# EAGLE design Amp5 (EAGLE 5.11)
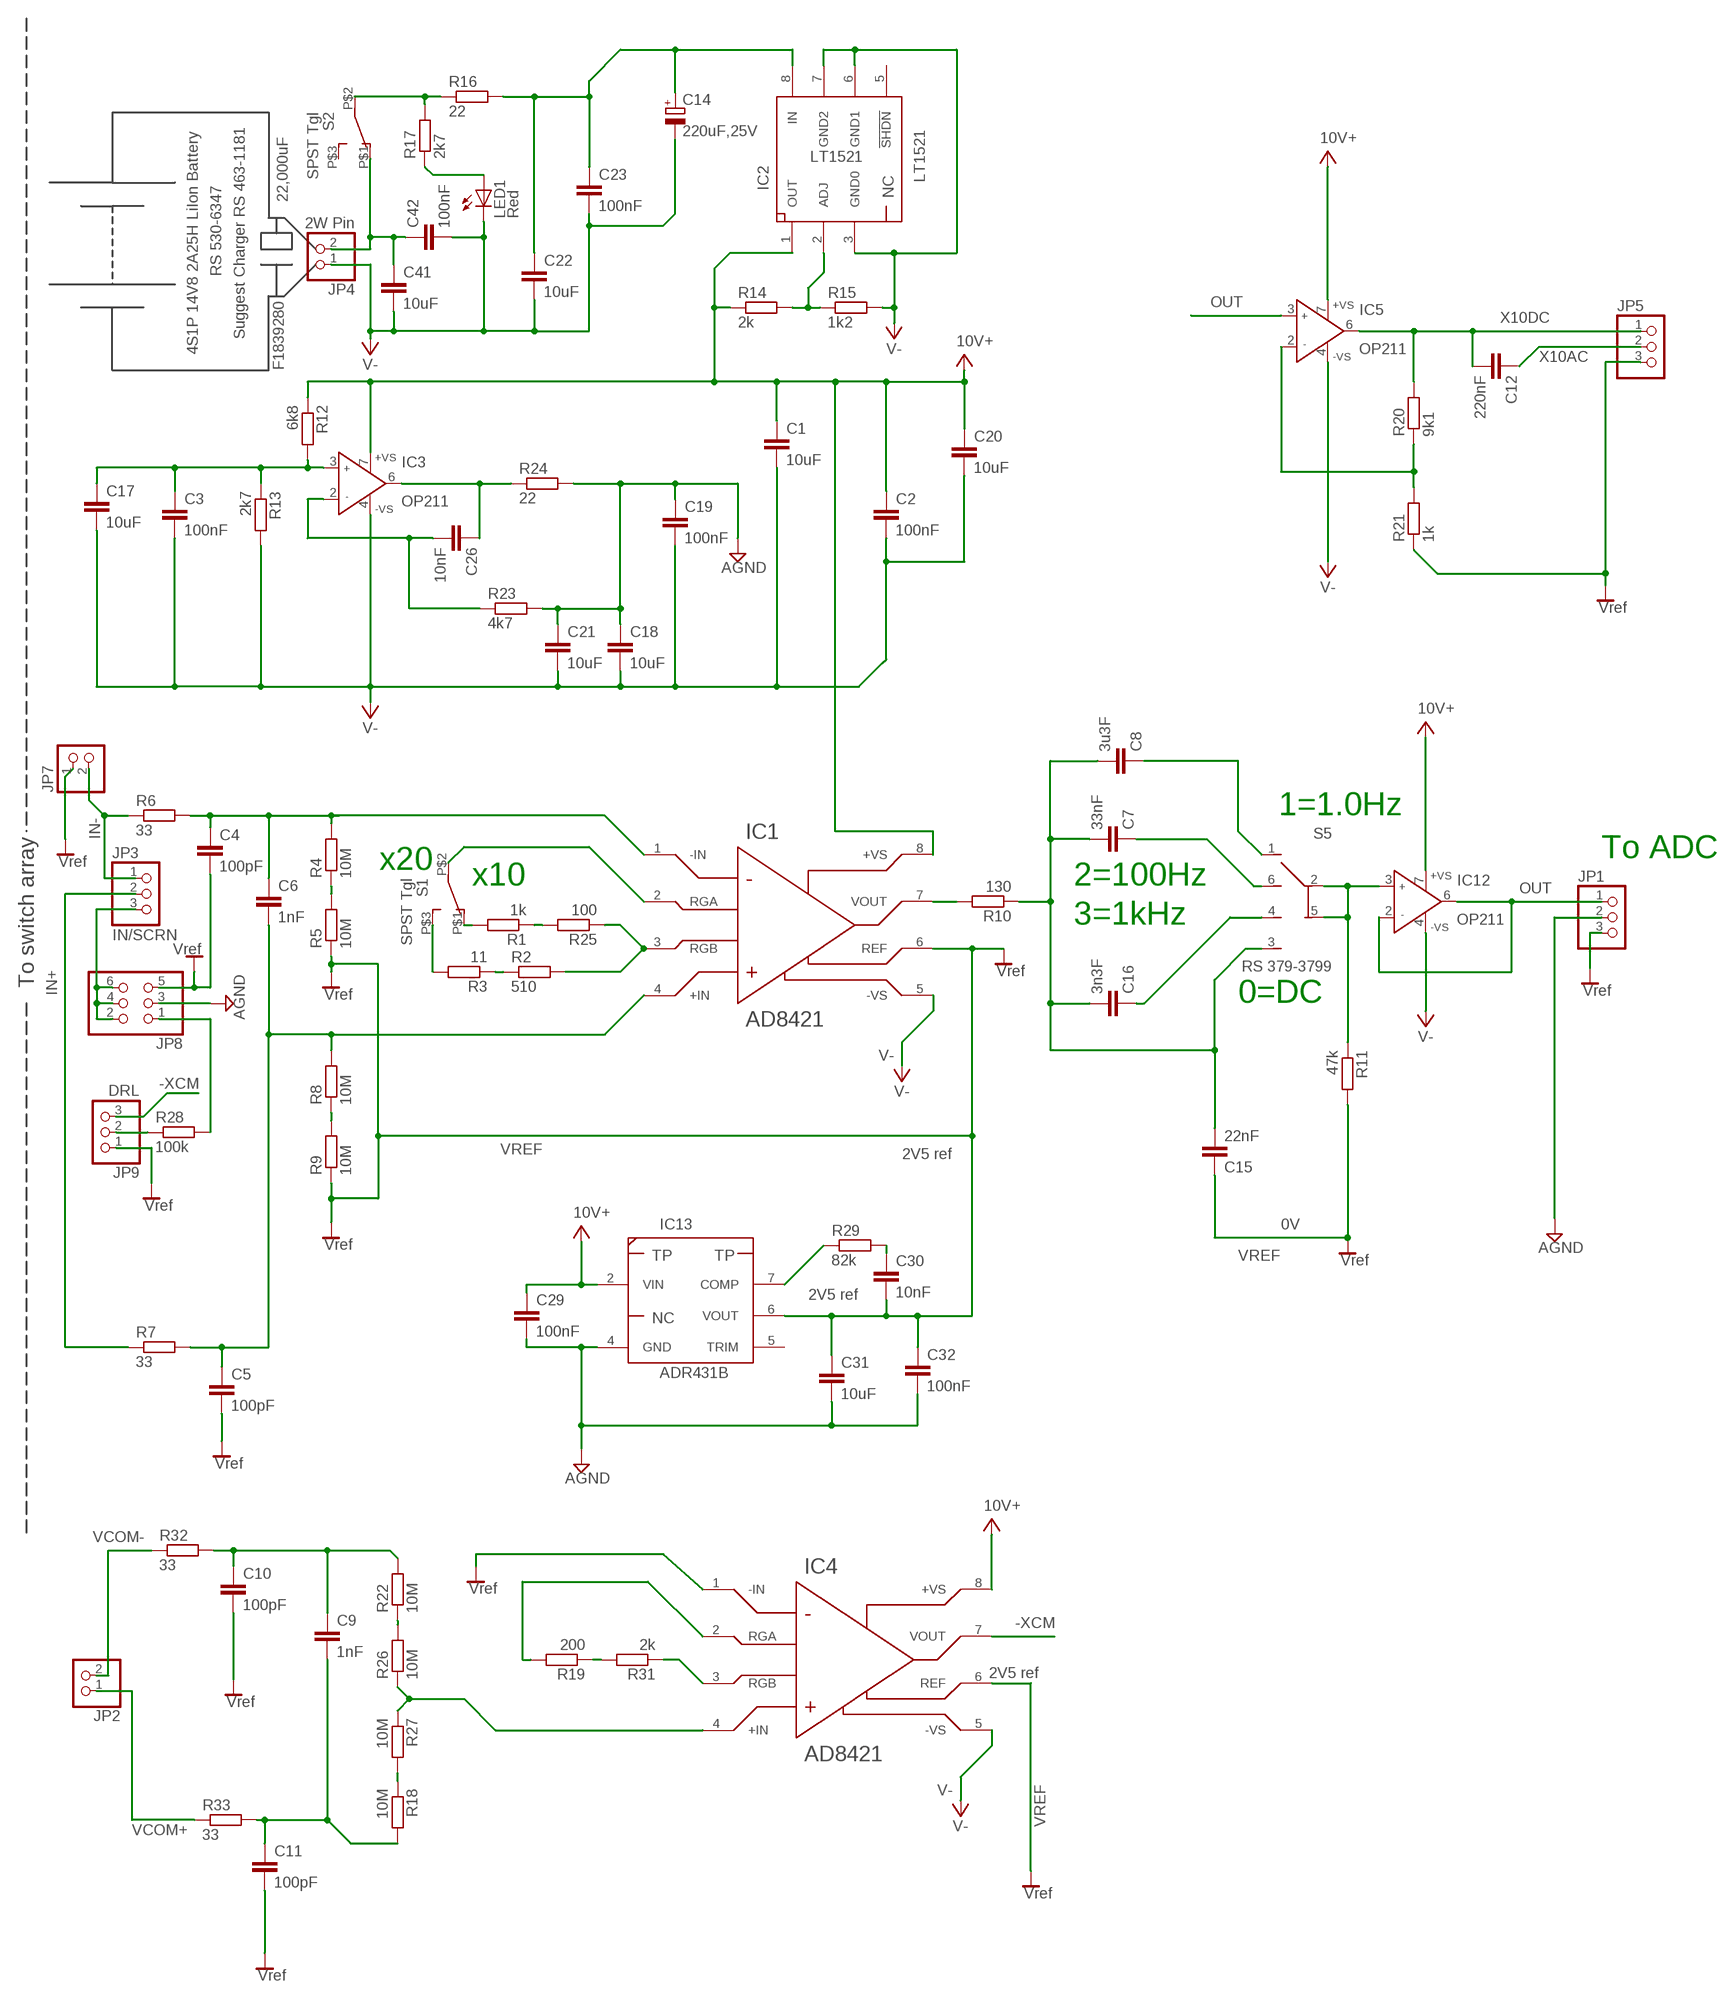
[diagram p0: schematic, sheet 1]

## Parts
C1  10uF  C-EUC1206  [C1206]
C2  100nF  C-EUC1206  [C1206]
C3  100nF  C-EUC1206  [C1206]
C4  100pF  C-EUC1206  [C1206]
C5  100pF  C-EUC1206  [C1206]
C6  1nF  C-EUC1206  [C1206]
C7  33nF  C-EUC1206  [C1206]
C8  3u3F  C-EUC1206  [C1206]
C9  1nF  C-EUC1206  [C1206]
C10  100pF  C-EUC1206  [C1206]
C11  100pF  C-EUC1206  [C1206]
C12  220nF  C-EUC1206  [C1206]
C14  220uF,25V  CPOL-EUE5-10.5  [E5-10,5]
C15  22nF  C-EUC1206  [C1206]
C16  3n3F  C-EUC1206  [C1206]
C17  10uF  C-EUC1206  [C1206]
C18  10uF  C-EUC1206  [C1206]
C19  100nF  C-EUC1206  [C1206]
C20  10uF  C-EUC1206  [C1206]
C21  10uF  C-EUC1206  [C1206]
C22  10uF  C-EUC1206  [C1206]
C23  100nF  C-EUC1206  [C1206]
C26  10nF  C-EUC1206  [C1206]
C29  100nF  C-EUC1206  [C1206]
C30  10nF  C-EUC1206  [C1206]
C31  10uF  C-EUC1206  [C1206]
C32  100nF  C-EUC1206  [C1206]
C41  10uF  C-EUC1206  [C1206]
C42  100nF  C-EUC1206  [C1206]
IC1  AD8421  [SO8]
IC2  LT1521  [SOIC8]
IC3  OP211  [SO-08]
IC4  AD8421  [SO8]
IC5  OP211  [SO-08]
IC12  OP211  [SO-08]
IC13  ADR431B  ADR43X  [SO-08]
JP1  PINHD-1X3  [1X03]
JP2  PINHD-1X2  [1X02]
JP3  IN/SCRN  PINHD-1X3  [1X03]
JP4  2W Pin  PINHD-1X2  [1X02]
JP5  PINHD-1X3  [1X03]
JP7  PINHD-1X2  [1X02]
JP8  PINHD-2X3  [2X03]
JP9  DRL  PINHD-1X3  [1X03]
LED1  Red  LED5MMR  [LED5MM]
R1  1k  R-EU_R0603  [R0603]
R2  510  R-EU_R0603  [R0603]
R3  11  R-EU_R0603  [R0603]
R4  10M  R-EU_R0603  [R0603]
R5  10M  R-EU_R0603  [R0603]
R6  33  R-EU_R0603  [R0603]
R7  33  R-EU_R0603  [R0603]
R8  10M  R-EU_R0603  [R0603]
R9  10M  R-EU_R0603  [R0603]
R10  130  R-EU_R0603  [R0603]
R11  47k  R-EU_R0603  [R0603]
R12  6k8  R-EU_R0603  [R0603]
R13  2k7  R-EU_R0603  [R0603]
R14  2k  R-EU_R0603  [R0603]
R15  1k2  R-EU_R0603  [R0603]
R16  22  R-EU_R0603  [R0603]
R17  2k7  R-EU_0309/10  [0309/10]
R18  10M  R-EU_R0603  [R0603]
R19  200  R-EU_R0603  [R0603]
R20  9k1  R-EU_R0603  [R0603]
R21  1k  R-EU_R0603  [R0603]
R22  10M  R-EU_R0603  [R0603]
R23  4k7  R-EU_R0603  [R0603]
R24  22  R-EU_R0603  [R0603]
R25  100  R-EU_R0603  [R0603]
R26  10M  R-EU_R0603  [R0603]
R27  10M  R-EU_R0603  [R0603]
R28  100k  R-EU_R0603  [R0603]
R29  82k  R-EU_R0603  [R0603]
R31  2k  R-EU_R0603  [R0603]
R32  33  R-EU_R0603  [R0603]
R33  33  R-EU_R0603  [R0603]
S1  SPST Tgl  SPDTSTGL  [SPDTSTGL]
S2  SPST Tgl  SPDTSTGL  [SPDTSTGL]
S5  RS 379-3799  SP_4W_DIL  [SP4W_DIL_SW]

## Nets
-XCM: IC4.7(VOUT) JP9.3
AGND: C18.1 C19.1 C21.1 C29.2 C31.2 C32.2 IC13.4(GND) JP1.2 JP8.3 R23.2 R24.2
DRL: JP8.1 R28.2
IN: C14.+ C22.1 C23.1 IC2.8(IN) R16.2
IN+: JP3.2 R7.1
IN-: JP3.1 JP7.2 R6.1
N$1: IC2.2(ADJ) R14.2 R15.1
N$2: C5.1 C6.2 IC1.4(+IN) R7.2 R8.2
N$3: IC1.7(VOUT) R10.2
N$4: R8.1 R9.2
N$5: IC1.2(RGA) S1.P$2(P)
N$6: R1.2 S1.P$1(O)
N$7: IC1.3(RGB) R2.2 R25.1
N$8: R3.2 S1.P$3(S)
N$9: R2.1 R3.1
N$10: C4.1 C6.1 IC1.1(-IN) R4.2 R6.2
N$11: C7.1 S5.6
N$12: R4.1 R5.2
N$13: C8.1 S5.1
N$14: C26.2 IC3.2(IN-) R23.1
N$15: C41.1 C42.1 JP4.2 S2.P$1(O)
N$16: C7.2 C8.2 C15.2 C16.2 R10.1 S5.3
N$17: R1.1 R25.2
N$18: C16.1 S5.4
N$19: LED1.A R17.1
N$20: C26.1 IC3.6(OUT) R24.1
N$21: IC5.2(IN-) R20.1 R21.2
N$22: IC12.3(IN+) R11.1 S5.2(CA) S5.5(CB)
N$23: R16.1 R17.2 S2.P$2(P)
N$24: C3.1 C17.1 IC3.3(IN+) R12.2 R13.1
N$25: JP3.3 JP8.2 JP8.4 JP8.6
N$26: IC4.2(RGA) R19.2
N$27: JP9.2 R28.1
N$29: IC13.7(COMP) R29.1
N$30: C30.1 R29.2
N$33: IC4.3(RGB) R31.1
N$34: R22.1 R26.2
N$35: R18.1 R27.2
N$38: R19.1 R31.2
N$39: C9.1 C10.1 R22.2 R32.2
N$40: C9.2 C11.1 R18.2 R33.2
OUT: IC5.3(IN+) IC12.2(IN-) IC12.6(OUT) JP1.1
V+: C1.1 C2.1 C20.1 C29.1 IC1.8(+VS) IC2.1(OUT) IC3.7(+VS) IC4.8(+VS) IC5.7(+VS) IC12.7(+VS) IC13.2(VIN) R12.1 R14.1 ; supply symbol labelled 10V+
V-: C1.2 C2.2 C3.2 C14.- C17.2 C18.2 C19.2 C20.2 C21.2 C22.2 C23.2 C41.2 C42.2 IC1.5(-VS) IC2.3(GND0) IC2.6(GND1) IC2.7(GND2) IC3.4(-VS) IC4.5(-VS) IC5.4(-VS) IC12.4(-VS) JP4.1 LED1.K(C) R13.2 R15.2
VCOM+: JP2.1 R33.1
VCOM-: JP2.2 R32.1
VCOMIN+: IC4.4(+IN) R26.1 R27.1
VREF: C4.2 C5.2 C10.2 C11.2 C15.1 C30.2 C31.1 C32.1 IC1.6(REF) IC4.1(-IN) IC4.6(REF) IC13.6(VOUT) JP1.3 JP5.3 JP7.1 JP8.5 JP9.1 R5.1 R9.1 R11.2 R21.1 ; supply symbol labelled Vref
X10AC: C12.1 JP5.2
X10DC: C12.2 IC5.6(OUT) JP5.1 R20.2
Unconnected: IC2.5(!SHDN) IC13.5(TRIM) S2.P$3(S)

## Notes on the sheet
- 22,000uF
- RS 530-6347
- Suggest Charger RS 463-1181
- 4S1P 14V8 2A25H LiIon Battery
- F1839280
- 1=1.0Hz
- x20
- To ADC
- x10 | 2=100Hz
- 3=1kHz
- To switch array
- 0=DC
- 2V5 ref
- 0V
- 2V5 ref
- 2V5 ref

## Library data of the parts
C1-C12 C15-C23 C26 C29-C32 C41 C42 = rcl:C-EU: CAPACITOR, European symbol
C14 = resistor:CPOL-EU: POLARIZED CAPACITOR, European symbol
IC1 IC4 = analog-devices:AD8421: AD8421 Lo noise, Lo power Instrumentation Amplifier
IC2 = linear-technology:LT1521: LT1521 Lo Drop Out, Adj Vreg
IC3 IC5 IC12 = texas:OP211: OP211 Lo noise rail to rail OPA, 30mA drive
IC13 = texas:ADR43X: ADR43x Voltage Reference
JP1 JP3 JP5 JP9 = pinhead:PINHD-1X3: PIN HEADER
JP2 JP4 JP7 = pinhead:PINHD-1X2: PIN HEADER
JP8 = pinhead:PINHD-2X3: PIN HEADER
LED1 = led:LED5MMR: Red 5mm LED
R1-R16 R18-R29 R31-R33 = rcl:R-EU_: RESISTOR, European symbol
R17 = resistor:R-EU_: RESISTOR, European symbol
S1 S2 = switch:SPDTSTGL: Solder Tag SPDT Toggle Sw
S5 = switch-dil:SP_4W_DIL: Single Pole 4 Way DIL Switch, RS 379-3799

## Board
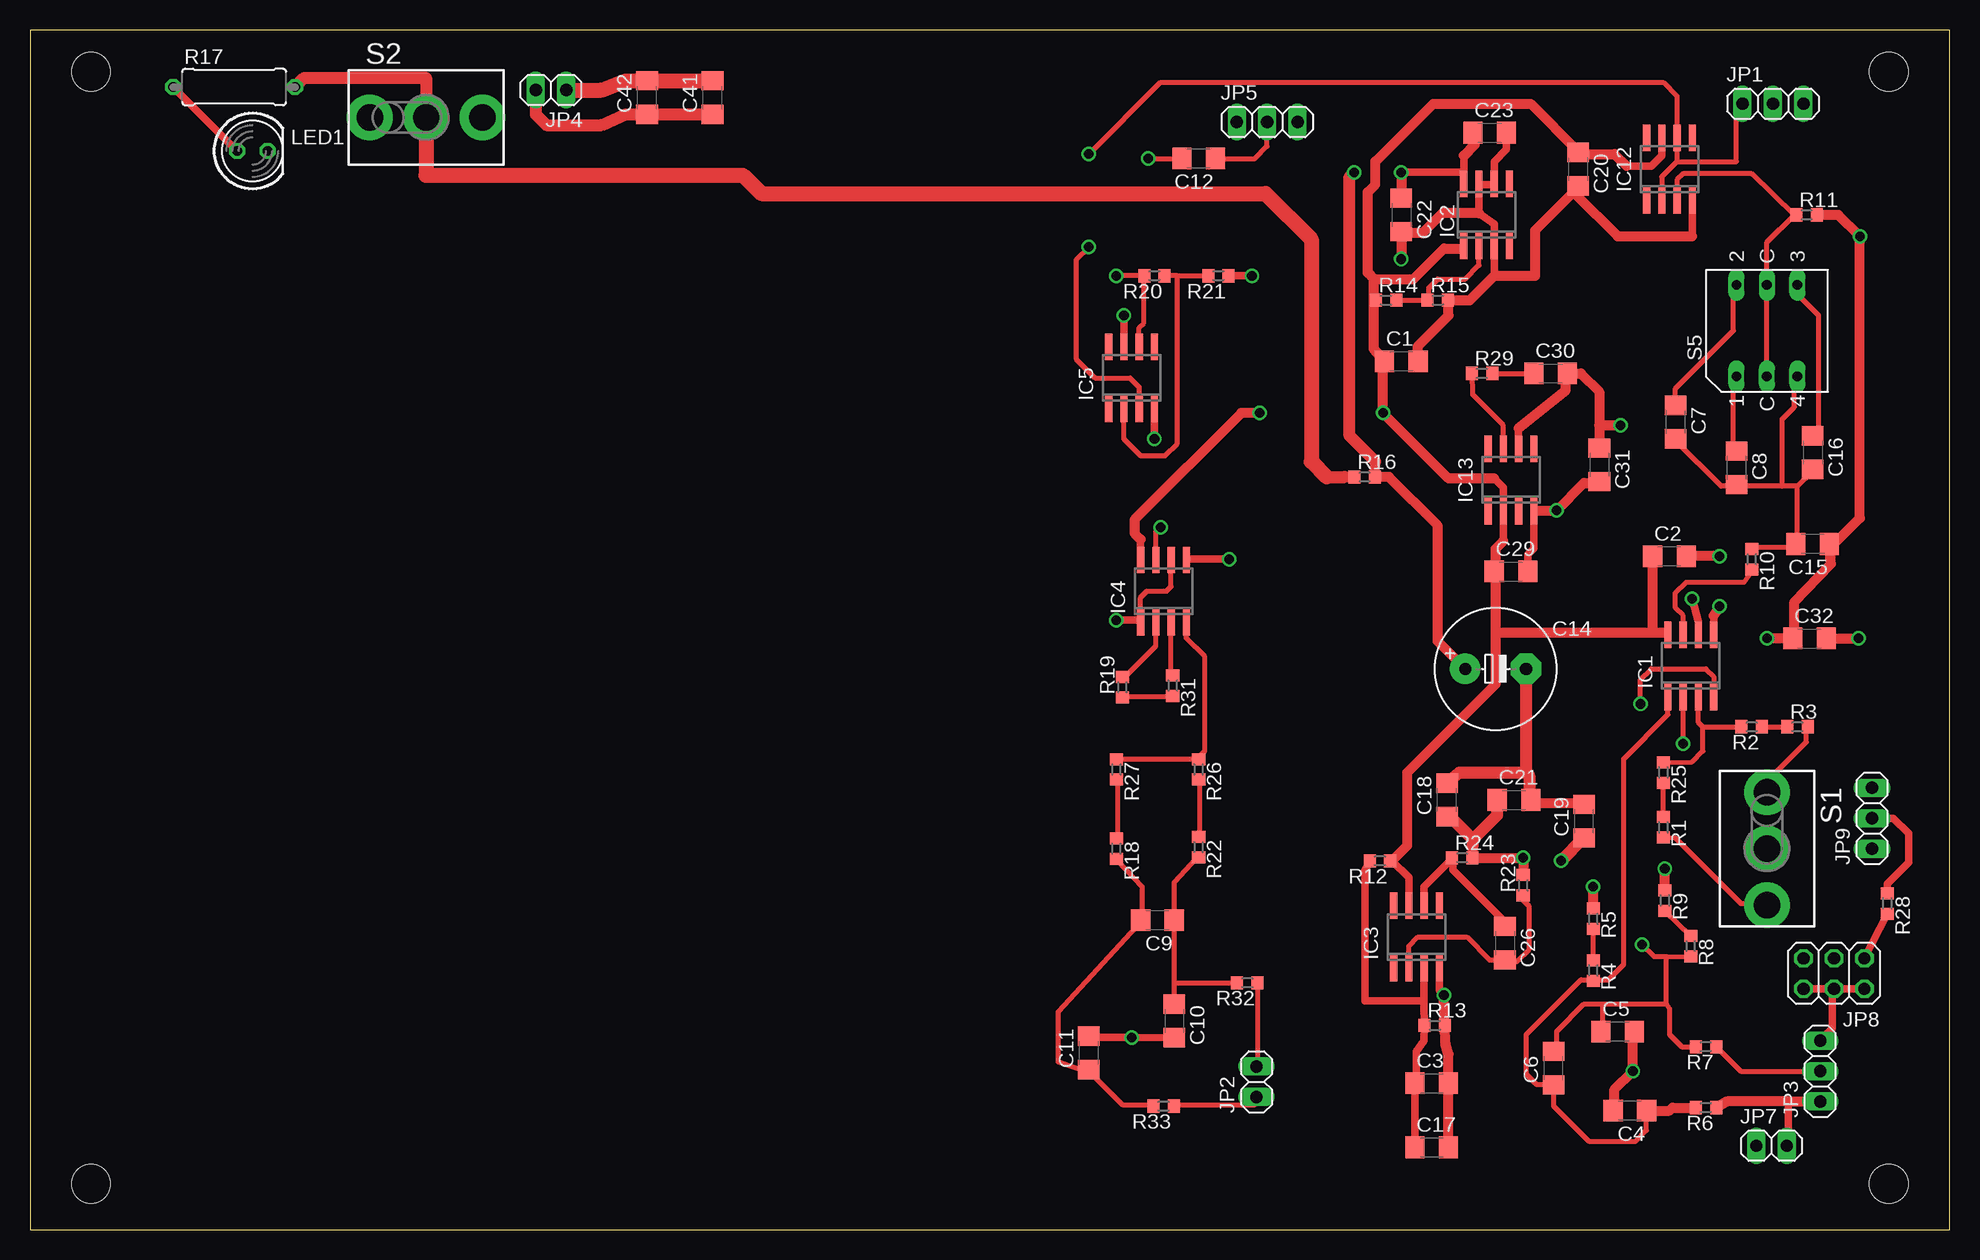
[diagram p1: board, top side]
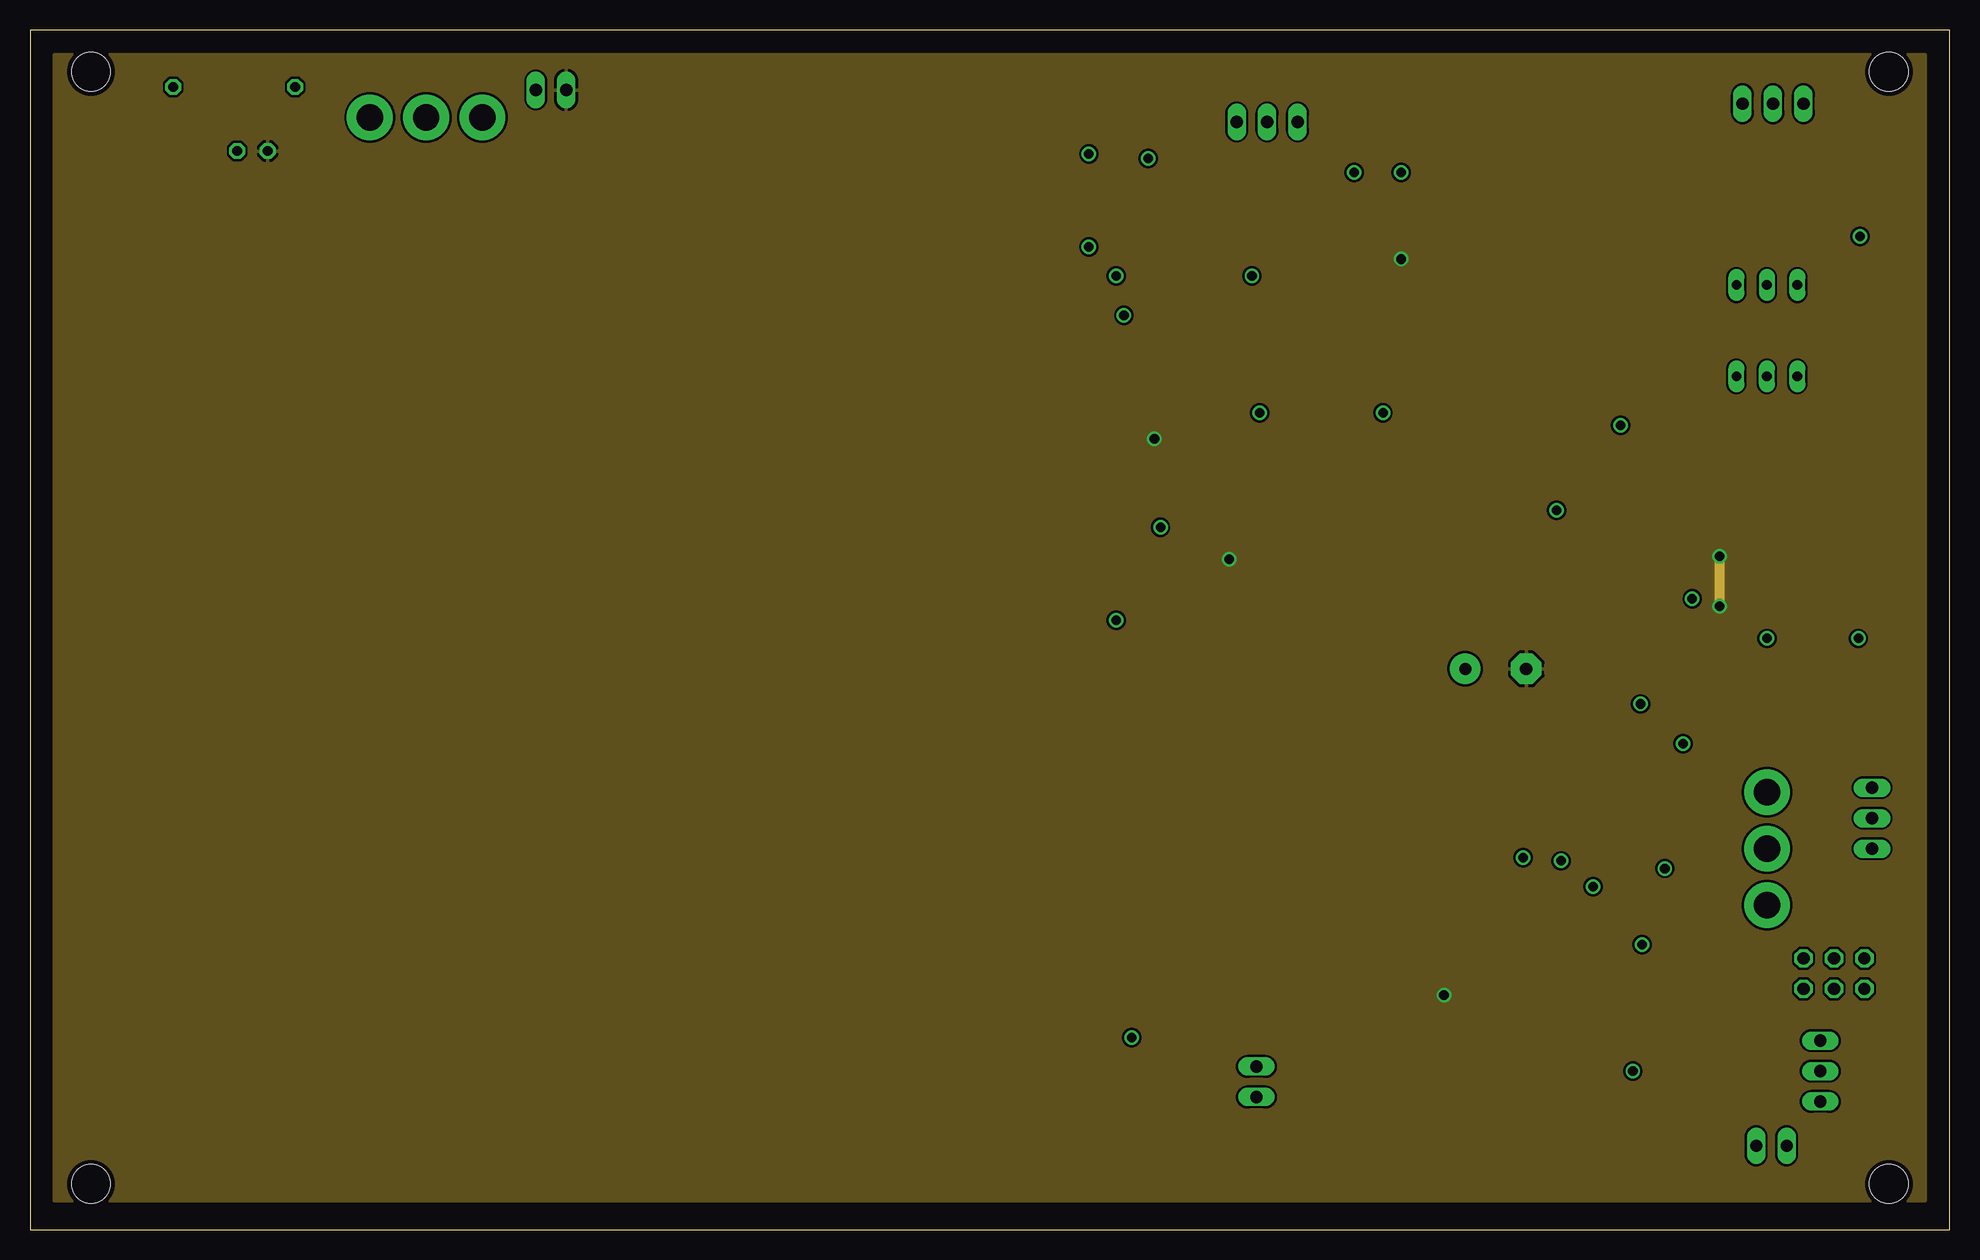
[diagram p2: board, inner layer Route2]
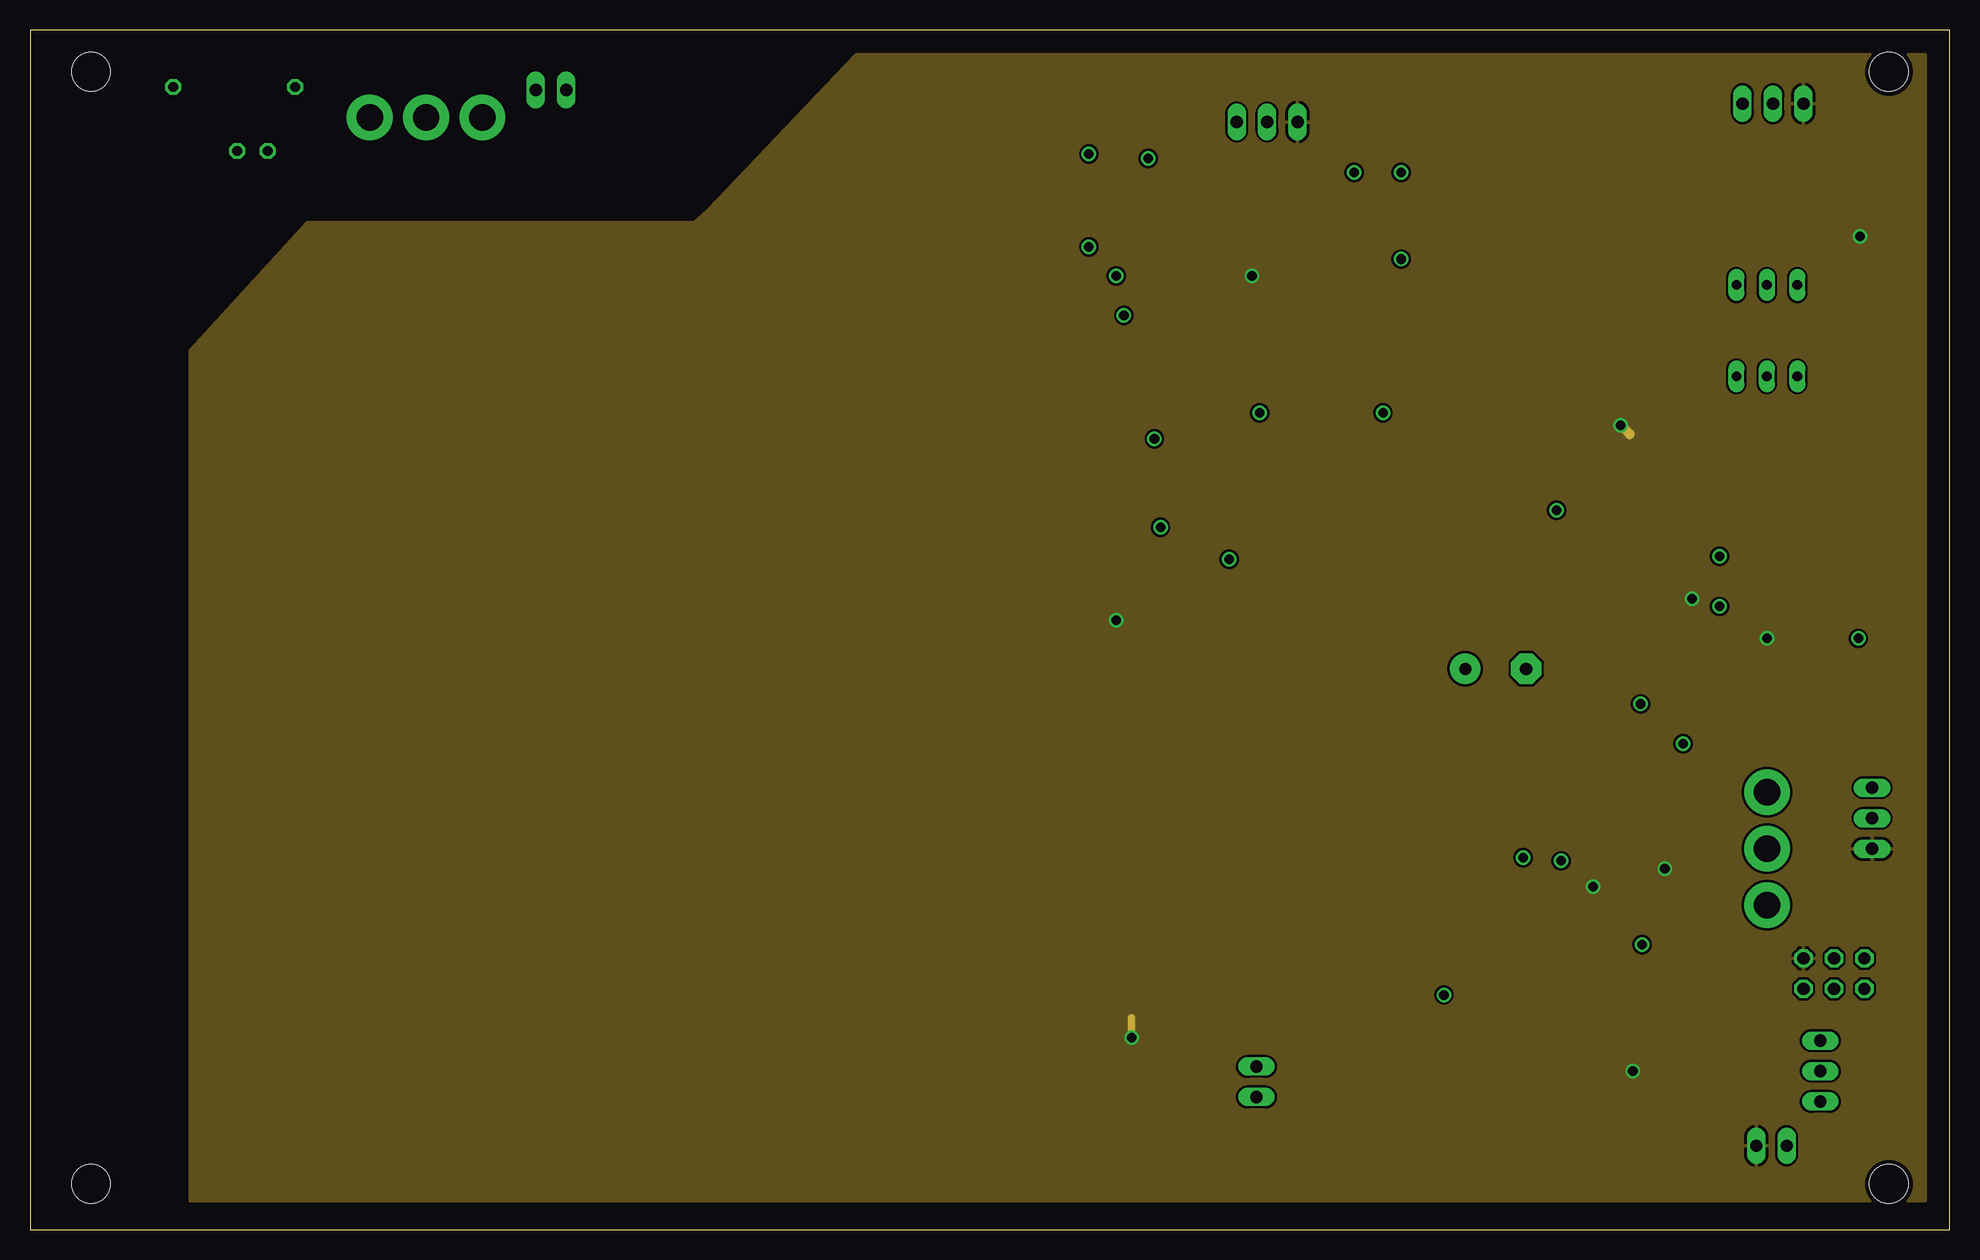
[diagram p3: board, inner layer Route15]
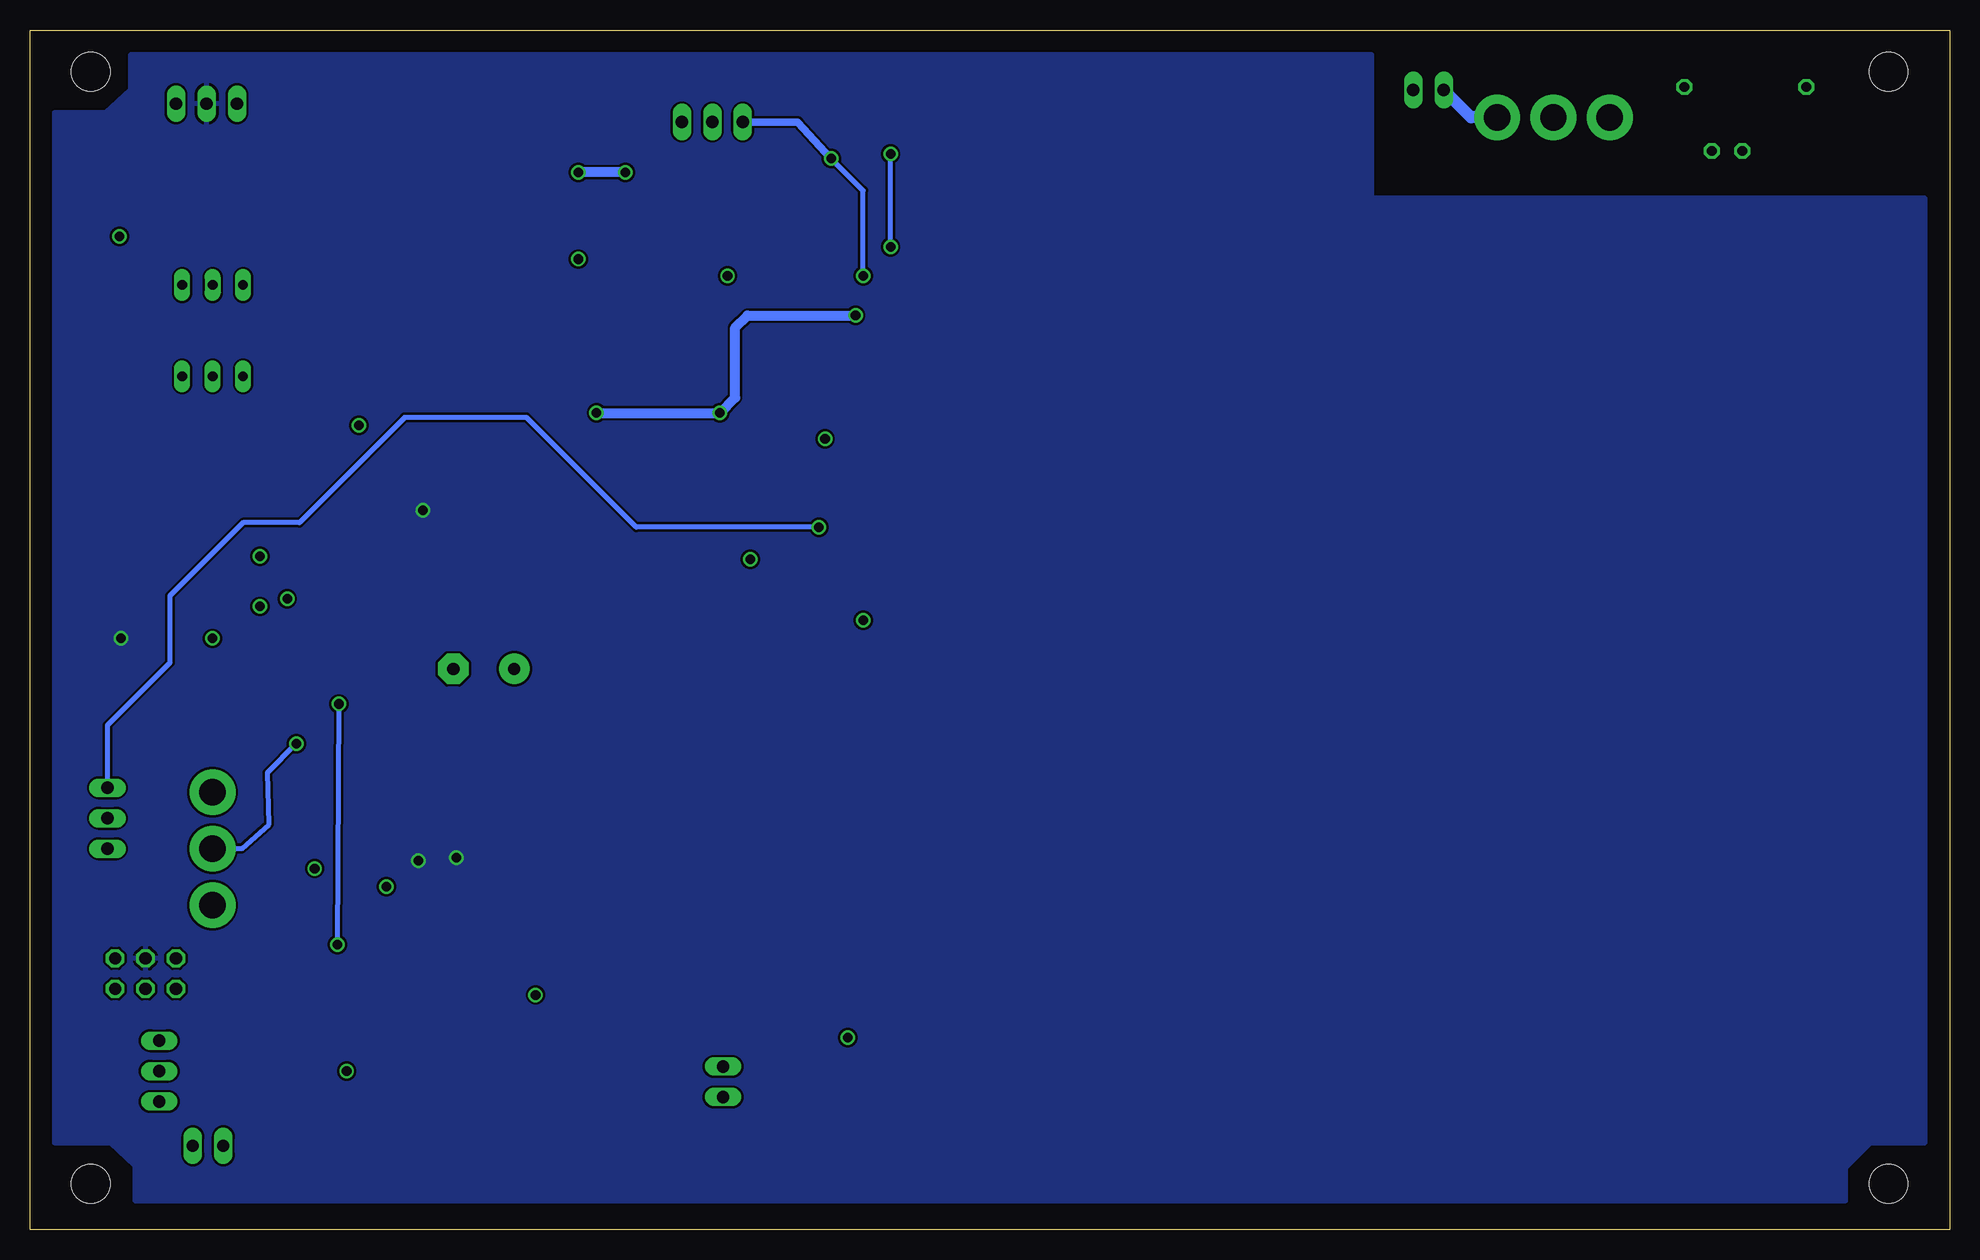
[diagram p4: board, bottom side, seen from below]

Size 160 x 100 mm. Coordinates in mm from the lower left corner, seen from the top.
Outline: 0,0 160,0 160,100 0,100 0,0
Copper layers (1+2*15+16): Top 0.018mm / dielectric 0.38mm / Route2 0.035mm / dielectric 0.71mm / Route15 0.035mm / dielectric 0.38mm / Bottom 0.018mm
Design rules "Tim": minimum track width 8mil, minimum drill 19mil, track to track 8mil, track to pad 7mil, pad to pad 7mil, via to via 8mil, smd to smd 7mil, copper to edge 15mil, drill to drill 8mil, minimum pad ring 10mil, minimum via ring 8mil, stop-mask expansion 4mil, vias tented up to drill 0mil, thermal gap 10mil
Holes 3.2 mm at 154.94,96.52 5.08,96.52 5.08,3.81 154.94,3.81

### Footprints (pad centres in the part's own frame; a part is rotated, then mirrored left to right if it is on the bottom)
C1206 = smd 1.6 x 1.8: 1 -1.4,0; 2 1.4,0
E5-10,5 = drill 1.016 pad 2.54 round: + -2.54,0 | drill 1.016 pad 2.54 octagon: - 2.54,0
SO8 = smd 0.6 x 2.2: 1 -1.905,-2.6; 2 -0.635,-2.6; 3 0.635,-2.6; 4 1.905,-2.6; 5 1.905,2.6; 6 0.635,2.6; 7 -0.635,2.6; 8 -1.905,2.6
SOIC8 = smd 0.6 x 2.2: 1 -1.905,-2.6; 2 -0.635,-2.6; 3 0.635,-2.6; 4 1.905,-2.6; 5 1.905,2.6; 6 0.635,2.6; 7 -0.635,2.6; 8 -1.905,2.6
SO-08 = smd 0.6 x 2.2: 1 -1.905,-2.6; 2 -0.635,-2.6; 3 0.635,-2.6; 4 1.905,-2.6; 5 1.905,2.6; 6 0.635,2.6; 7 -0.635,2.6; 8 -1.905,2.6
1X03 = drill 1.016 long: 1 -2.54,0; 2 0,0; 3 2.54,0
1X02 = drill 1.016 long: 1 -1.27,0; 2 1.27,0
2X03 = drill 1.016 octagon: 1 -2.54,-1.27; 2 -2.54,1.27; 3 0,-1.27; 4 0,1.27; 5 2.54,-1.27; 6 2.54,1.27
LED5MM = drill 0.813 octagon: A -1.27,0; K 1.27,0
R0603 = smd 1 x 1.1: 1 -0.85,0; 2 0.85,0
0309/10 = drill 0.813 octagon: 1 -5.08,0; 2 5.08,0
SPDTSTGL = drill 2.2 pad 3.81 round: P$1 4.699,0; P$2 0,0; P$3 -4.699,0
SP4W_DIL_SW = drill 0.813 long: 1 -2.54,-3.81; 2 0,-3.81; 3 2.54,-3.81; 4 2.54,3.81; 5 0,3.81; 6 -2.54,3.81

### Placement (x,y rotation side)
C1  114.3,72.39 0 top
C2  136.65,56.13 0 top
C3  116.84,12.19 0 top
C4  133.35,9.91 180 top
C5  132.33,16.51 0 top
C6  127,13.46 90 top
C7  137.16,67.31 270 top
C8  142.24,63.5 270 top
C9  93.98,25.78 180 top
C10  95.38,17.4 270 top
C11  88.27,14.73 90 top
C12  97.41,89.28 180 top
C14  122.17,46.74 0 top
C15  148.59,57.15 180 top
C16  148.59,64.77 270 top
C17  116.84,6.86 0 top
C18  118.11,35.81 90 top
C19  129.54,34.04 90 top
C20  129.03,88.39 270 top
C21  123.7,35.81 0 top
C22  114.3,84.58 270 top
C23  121.67,91.44 0 top
C26  122.94,23.88 270 top
C29  123.44,54.86 0 top
C30  126.75,71.37 0 top
C31  130.81,63.75 270 top
C32  148.34,49.28 0 top
C41  56.9,94.36 90 top
C42  51.44,94.36 90 top
IC1  138.43,46.99 0 top
IC2  121.41,84.58 0 top
IC3  115.57,24.38 0 top
IC4  94.49,53.21 0 top
IC5  91.82,70.99 0 top
IC12  136.65,88.39 0 top
IC13  123.44,62.48 0 top
JP1  145.29,93.85 0 top
JP2  102.23,12.32 90 top
JP3  149.22,13.21 90 top
JP4  43.43,95 180 top
JP5  103.12,92.33 0 top
JP7  145.16,6.99 0 top
JP8  150.37,21.34 180 top
JP9  153.54,34.29 90 top
LED1  18.54,89.92 0 top
R1  136.14,33.53 270 top
R2  143.51,41.91 180 top
R3  147.32,41.91 0 top
R4  130.3,21.59 270 top
R5  130.3,25.91 270 top
R6  139.7,10.16 180 top
R7  139.7,15.24 180 top
R8  138.43,23.62 270 top
R9  136.27,27.43 270 top
R10  143.51,55.88 270 top
R11  148.08,84.58 0 top
R12  112.52,30.73 180 top
R13  117.09,17.02 0 top
R14  113.03,77.47 0 top
R15  117.35,77.47 0 top
R16  111.25,62.74 0 top
R17  17.02,95.25 0 top
R18  90.55,31.75 270 top
R19  91.06,45.21 90 top
R20  93.73,79.5 180 top
R21  99.06,79.5 180 top
R22  97.41,31.88 270 top
R23  124.46,28.7 90 top
R24  119.38,30.99 0 top
R25  136.14,38.1 270 top
R26  97.41,38.35 270 top
R27  90.55,38.35 270 top
R28  154.81,27.18 270 top
R29  121.03,71.37 0 top
R31  95.25,45.34 270 top
R32  101.47,20.57 180 top
R33  94.49,10.29 180 top
S1  144.78,31.75 270 top
S2  33.02,92.71 0 top
S5  144.78,74.93 0 top

### Tracks (layer width: path | path; a pad name or v marks a point on that pad's centre or on a via)
-XCM  (via drill 0.8)
  Top 0.406: IC4.7 93.85,58.17 v94.23,58.55
  Bottom 0.406: v94.23,58.55 109.47,58.55 118.62,67.69 128.78,67.69 137.54,58.93 142.24,58.93 148.34,52.83 148.34,47.24 153.54,42.04 JP9.3
AGND  (via drill 0.8)
  Top 0.406: 130.56,62.23 C31.2 | IC13.4 125.48,59.94
  Top 0.61: C29.2 124.84,56.26 125.35,56.77 IC13.4
  Top 0.813: 130.56,62.23 129.54,62.23 v127.25,59.94 125.48,59.94 | R23.2 v124.46,30.99 R24.2 120.27,32 | C32.2 v152.4,49.28
  Top 1.016: 120.27,32 120.27,32.51 | C18.1 118.36,34.42 120.27,32.51 | 120.27,32.51 122.3,34.54 C21.1 | v127.64,30.73 C19.1
  pour Bottom: 157.99,7.24 153.29,7.24 151.26,5.33 151.26,2.41 8.64,2.41 8.64,5.21 6.6,7.24 2.03,7.24 2.03,85.98 48.13,85.98 48.13,97.92 151.64,97.92 151.64,95 153.67,93.09 157.99,93.09
DRL
  Top 0.61: JP8.1 R28.2
IN  (via drill 0.8)
  Top 0.203: 112.39,62.74 R16.2
  Top 0.406: 119.51,88.14 IC2.8
  Top 0.61: 119.51,89.53 119.51,88.14 v114.3,88.14
  Top 0.813: 119.51,89.53 120.4,90.42 C23.1 | 112.39,62.74 113.28,62.74 117.35,58.67 117.35,49.02 C14.+ | 109.98,87.76 v110.36,88.14 | v114.3,88.14 C22.1 | R16.2 112.14,64.01
  Top 1.016: 109.98,87.76 109.98,66.17 112.14,64.01
  Bottom 0.813: v110.36,88.14 v114.3,88.14
IN+
  Top 0.406: R7.1 142.62,13.21 JP3.2
IN-
  Top 0.61: JP7.2 146.56,7.11 146.56,10.67
  Top 0.813: R6.1 141.48,10.67 146.56,10.67 JP3.1
N$1
  Top 0.406: R14.2 R15.1 116.59,77.47 116.59,78.49 117.35,79.25 119.63,79.25 120.78,80.39 IC2.2
N$2  (via drill 0.8)
  Top 0.406: 131.06,18.8 129.54,18.8 127.25,16.51 127.25,14.99 C6.2 | 131.06,18.8 136.4,18.8 | 136.4,18.8 136.4,22.73 | 136.4,22.73 R8.2 | 136.4,18.8 136.65,18.41 136.65,16.26 137.67,15.24 R7.2 | v134.24,43.81 134.24,45.85 135.13,46.74 139.7,46.74 140.34,46.1 IC1.4 | 136.4,22.73 135.38,22.73 v134.37,23.75 | 131.06,18.8 131.06,16.51 C5.1
  Bottom 0.406: v134.37,23.75 v134.24,43.81
N$3
  Top 0.406: R10.2 143.51,54.86 142.88,53.98 138.05,53.98 137.16,53.09 137.16,51.82 137.79,51.18 IC1.7
N$4
  Top 0.406: R9.2 R8.1
N$5  (via drill 0.8)
  Top 0.406: v137.79,40.51 IC1.2
  Bottom 0.406: v137.79,40.51 140.21,38.1 140.08,33.78 142.37,31.75 S1.P$2
N$6
  Top 0.406: R1.2 137.16,32.64 142.62,27.18 144.78,27.18 S1.P$1
N$7
  Top 0.406: 139.45,41.91 R2.2 | 139.45,41.91 139.06,42.29 IC1.3 | 139.45,41.91 139.45,39.88 138.56,38.99 R25.1
N$8
  Top 0.406: R3.2 148.08,41.91 148.08,40.64 144.78,37.34 S1.P$3
N$9
  Top 0.406: R2.1 R3.1
N$10
  Top 0.406: 130.3,20.83 129.29,20.83 124.71,16.26 124.71,12.95 125.6,12.06 C6.1 127,10.29 129.92,7.37 133.86,7.37 134.75,8.26 C4.1 | 130.3,20.83 131.57,20.83 132.84,22.1 132.84,39.24 136.53,42.93 IC1.1 | 130.3,20.83 R4.2
  Top 0.813: R6.2 136.91,10.16 136.65,9.91 C4.1
N$11
  Top 0.406: S5.6 141.99,78.49 141.99,74.93 137.16,70.1 C7.1
N$12
  Top 0.406: R4.1 R5.2
N$13
  Top 0.406: S5.1 141.99,70.87 141.99,65.28 142.24,65.02 C8.1
N$14
  Top 0.406: R23.1 124.46,27.43 124.97,26.92 124.97,23.37 123.95,22.35 C26.2 122.69,22.48 121.67,22.48 119.76,24.38 115.7,24.38 114.94,23.62 IC3.2
N$15
  Top 0.203: C42.1 51.31,92.96
  Top 1.016: 51.31,92.96 56.64,92.96 C41.1 | JP4.2 42.16,92.96 43.05,92.08 47.62,92.08 49.66,92.96 C42.1
  Bottom 1.016: JP4.2 39.88,92.71 S2.P$1
N$16
  Top 0.406: R10.1 143.51,56.9 147.07,56.9 147.07,57.15 C15.2 147.32,57.15 147.32,61.98 | 147.32,61.98 148.59,63.25 C16.2 | 147.32,61.98 146.05,61.98 | 146.05,61.98 142.24,61.98 | 142.24,61.98 140.97,61.98 137.16,65.79 C7.2 | 142.24,61.98 C8.2 | S5.3 147.07,70.87 147.07,68.58 146.05,67.56 146.05,61.98
N$17
  Top 0.406: R1.1 R25.2
N$18
  Top 0.406: S5.4 147.32,77.98 149.1,76.2 149.1,66.8 148.59,66.29 C16.1
N$19
  Top 0.61: LED1.A R17.1
N$20
  Top 0.406: 118.36,30.73 R24.1 118.62,30.73 | IC3.6 116.2,26.92 | 123.19,25.4 C26.1
  Top 0.61: 118.36,30.73 116.2,28.57 IC3.6 | 123.19,25.4 118.62,29.97 118.62,30.73
N$21
  Top 0.406: 95.63,79.5 R20.1 | 95.63,79.5 R21.2 | 95.63,79.5 95.63,65.53 94.61,64.52 92.58,64.52 91.19,65.91 IC5.2
N$22
  Top 0.406: 147.07,84.58 144.78,82.3 S5.5 S5.2 | 147.07,84.58 143.51,88.01 137.79,88.01 137.29,87.5 IC12.3 137.29,85.72 | 147.07,84.58 R11.1
N$23
  Top 0.203: R16.1 110.49,62.74
  Top 0.813: 109.6,62.74 R16.1
  Top 1.016: 108.08,62.74 109.6,62.74 | R17.2 22.86,96.01 33.02,96.01 S2.P$2
  Top 1.27: 108.08,62.74 106.81,64.01 106.81,82.55 103,86.36 60.96,86.36 59.44,87.88 33.02,87.88 S2.P$2
N$24
  Top 0.203: 111.76,30.73 R12.2
  Top 0.406: C17.1 115.44,6.73 | 115.44,12.06 C3.1 115.57,12.19
  Top 0.61: 115.44,6.73 115.44,12.06 | 116.2,19.05 116.2,18.8 R13.1 116.2,15.75 115.57,14.86 115.57,12.19 | 116.2,19.05 IC3.3 | 111.76,30.73 111.25,29.97 111.25,19.05 116.2,19.05
N$25
  Top 0.203: 150.24,20.07 JP8.4
  Top 0.61: JP3.3 150.24,16.76 150.24,20.07 JP8.6 | JP8.4 JP8.2
N$26
  Top 0.203: IC4.2 93.85,50.67
  Top 0.406: IC4.2 93.85,48.64 91.44,46.23 R19.2
N$27
  Top 0.61: R28.1 154.81,28.83 156.59,30.61 156.59,33.02 155.32,34.29 JP9.2
N$29
  Top 0.406: R29.1 120.27,70.23 120.27,69.6 122.81,67.06 IC13.7
N$30
  Top 0.406: R29.2 C30.1
N$33
  Top 0.203: R31.1 95.12,46.23
  Top 0.406: 95.12,46.23 IC4.3
N$34
  Top 0.203: R22.1 97.54,32.77 | 97.54,37.34 R26.2
  Top 0.406: 97.54,32.77 97.54,37.34
N$35
  Top 0.203: R18.1 90.68,32.77 | 90.68,37.34 R27.2
  Top 0.406: 90.68,32.77 90.68,37.34
N$38
  Top 0.203: 95.5,44.45 R31.2
  Top 0.406: 95.5,44.45 91.44,44.45 R19.1
N$39
  Top 0.203: 97.28,30.99 R22.2 | 95.38,25.65 C9.1
  Top 0.406: 95.38,20.57 R32.2 | 97.28,30.99 95.38,28.96 95.38,25.65 95.38,20.57 | C10.1 95.38,20.57
N$40
  Top 0.203: 90.68,30.73 R18.2 | 88.39,13.08 C11.1 | 93.47,10.41 R33.2
  Top 0.406: 90.68,30.73 92.71,28.57 92.71,25.78 | 93.47,10.41 91.06,10.41 88.39,13.08 85.72,13.97 85.72,18.16 92.71,25.78 | 92.71,25.78 C9.2
OUT  (via drill 0.8)
  Top 0.406: 137.29,89.03 136.02,87.76 IC12.2 136.02,85.72 | 137.29,89.03 142.24,89.03 142.24,93.22 142.75,93.73 JP1.1 | 137.29,89.03 IC12.6 137.29,94.49 136.14,95.63 94.23,95.63 v88.27,89.66 | IC5.3 92.46,70.23 91.69,70.99 88.77,70.99 87.25,72.52 87.25,80.9 v88.27,81.92
  Bottom 0.406: v88.27,81.92 v88.27,89.66
V+  (via drill 0.8)
  Top 0.203: 91.19,72.9 IC5.7
  Top 0.406: 122.17,54.86 C29.1 122.17,54.1 | 129.03,89.66 C20.1 129.03,89.92 | 112.01,77.47 R14.1 | 119.38,81.79 IC2.1 | 113.54,30.73 R12.1 | IC1.8 136.4,49.78 | 112.78,72.14 C1.1
  Top 0.61: 135.25,49.78 IC1.8 | 122.81,57.4 IC13.2 122.81,61.85 122.05,62.61 | 133.1,88.65 135.13,88.65 136.02,89.53 IC12.7 | 113.54,30.73 114.94,29.34 IC3.7 | 92.58,57.53 IC4.8 | v91.19,76.2 91.19,72.9
  Top 0.813: 135.25,49.78 135.25,53.47 C2.1 | 122.17,54.86 122.17,56.77 122.81,57.4 | 129.03,89.66 132.08,89.66 133.1,88.65 | C1.1 112.01,73.41 112.01,77.47 112.01,79.25 | 119.38,81.79 117.86,81.79 115.32,79.25 112.01,79.25 | 129.03,89.92 125.09,93.85 116.97,93.85 112.14,89.03 112.14,87.12 111.51,86.49 111.51,79.76 112.01,79.25 | 113.54,30.73 114.81,32 114.81,38.1 122.17,45.47 122.17,49.78 | 122.17,49.78 122.17,54.1 | 122.17,49.78 135.25,49.78 | 135.25,49.78 136.4,49.78 | 122.05,62.61 118.24,62.61 v112.78,68.07 112.78,72.14 | 92.58,57.53 92.08,58.04 92.08,59.18 100.97,68.07 v102.49,68.07
  Bottom 0.813: v91.19,76.2 100.2,76.2 101.22,75.18 101.22,69.34 v102.49,68.07 v112.78,68.07
V-  (via drill 0.8)
  Top 0.203: 51.31,95.76 C42.2 | IC4.5 96.52,55.88
  Top 0.406: C20.2 129.03,86.87 128.78,86.61 128.78,86.36 | C18.2 118.11,37.59 | 118.24,77.09 R15.2 | C17.2 118.24,7.11 | 118.24,12.32 C3.2 | 114.55,83.06 C22.2 | 121.92,87.12 IC2.6 | IC2.7 120.9,87.12 | 124.97,35.81 C21.2 125.22,35.81 125.22,35.56 | 129.54,35.56 C19.2
  Top 0.61: 138.56,82.8 IC12.4 | 122.05,79.5 IC2.3 122.05,83.82 120.78,84.71 IC2.7 | 128.78,86.61 C20.2 | v117.86,19.56 117.47,19.94 IC3.4 | C23.2 123.06,90.04 122.05,89.03 IC2.6 | IC1.5 140.34,51.18 | 120.9,87.12 121.92,87.12 | v93.73,65.91 IC5.4 | 96.52,55.88 v99.95,55.88
  Top 0.813: 138.56,82.8 132.33,82.8 128.78,86.36 | 128.78,86.61 125.48,83.31 125.48,79.5 122.05,79.5 120.02,77.47 R15.2 | 118.24,77.09 118.24,76.2 115.7,73.66 C1.2 | v117.86,19.56 117.86,19.3 R13.2 117.98,15.49 118.24,14.61 118.24,12.32 118.24,7.11 | 140.34,51.18 v140.84,51.94 | v140.84,56.13 C2.2 | C22.2 v114.3,80.9 | 114.55,83.06 116.08,83.06 117.73,84.71 120.78,84.71 | 125.22,35.56 129.54,35.56
  Top 1.016: 124.71,38.1 124.97,37.85 124.97,35.81 | 124.71,38.1 119.13,38.1 C18.2 | 124.71,38.1 C14.-
  Top 1.27: C41.2 56.64,95.76 51.31,95.76 49.66,95.76 47.62,95 JP4.1
  Route2 0.813: v140.84,51.94 v140.84,56.13
  pour Route2: 157.99,2.41 2.03,2.41 2.03,97.92 157.99,97.92
VCOM+
  Top 0.203: 102.11,10.92 JP2.1
  Top 0.406: 102.11,10.92 102.11,10.41 95.5,10.41 R33.1
VCOM-
  Top 0.203: 102.36,20.57 R32.1
  Top 0.406: 102.36,20.57 102.36,13.72 JP2.2
VCOMIN+
  Top 0.203: R27.1 90.68,39.24 | 97.28,39.24 R26.1
  Top 0.406: 90.68,39.24 97.28,39.24 97.92,39.88 97.92,47.75 96.39,49.28 IC4.4
VREF  (via drill 0.8)
  Top 0.203: 130.81,65.28 C31.1 | C32.1 147.07,49.53 | 132.08,10.41 132.08,9.91 C4.2 | IC4.1 92.46,50.8
  Top 0.406: 128.02,71.12 C30.2 | IC1.6 139.06,49.66 | 133.6,16.51 C5.2 | v91.82,16 91.95,16 | IC4.6 95.12,53.59 94.74,53.21 93.09,53.21 92.58,52.7 IC4.1
  Top 0.61: R5.1 130.3,27.43 | IC13.6 124.08,66.8 | v138.56,52.58 139.06,50.67 IC1.6 | R21.1 v101.85,79.5 | v91.82,16 88.39,16 C11.2 | 91.95,16 C10.2 | 92.46,50.8 v90.55,50.8
  Top 0.813: 130.3,27.43 v130.3,28.57 | C30.2 129.29,71.37 130.81,69.85 130.81,67.06 | 130.81,67.06 130.81,65.28 | 130.81,67.06 v132.59,67.06 | 124.08,66.8 128.02,69.98 128.02,71.12 | R9.1 v136.27,30.1 | C32.1 v144.78,49.28 | 150.11,55.5 150.11,56.9 152.53,59.31 v152.53,82.8 150.75,84.58 R11.2 | 150.11,55.5 147.07,52.32 147.07,49.53 | 150.11,55.5 C15.1 | 133.6,16.51 v133.6,13.21 132.08,11.68 132.08,10.41
  Route15 0.61: v91.82,16 91.82,17.65
  Route15 0.813: v132.59,67.06 133.35,66.29
  pour Route15: 157.99,2.41 13.34,2.41 13.34,73.28 23.11,83.95 55.37,83.95 56.52,84.96 68.83,97.92 157.99,97.92
X10AC
  Top 0.406: C12.1 102.11,89.28 103.12,90.3 JP5.2
X10DC  (via drill 0.8)
  Top 0.203: 92.84,79.38 R20.2
  Top 0.406: 92.84,79.38 92.84,75.56 92.46,75.18 IC5.6 | v93.22,89.28 C12.2 | R20.2 v90.55,79.5
  Bottom 0.406: v93.22,89.28 90.55,86.61 v90.55,79.5
  Bottom 0.61: JP5.1 96.01,92.33 v93.22,89.28